# EAGLE design board (EAGLE 9.3.0)
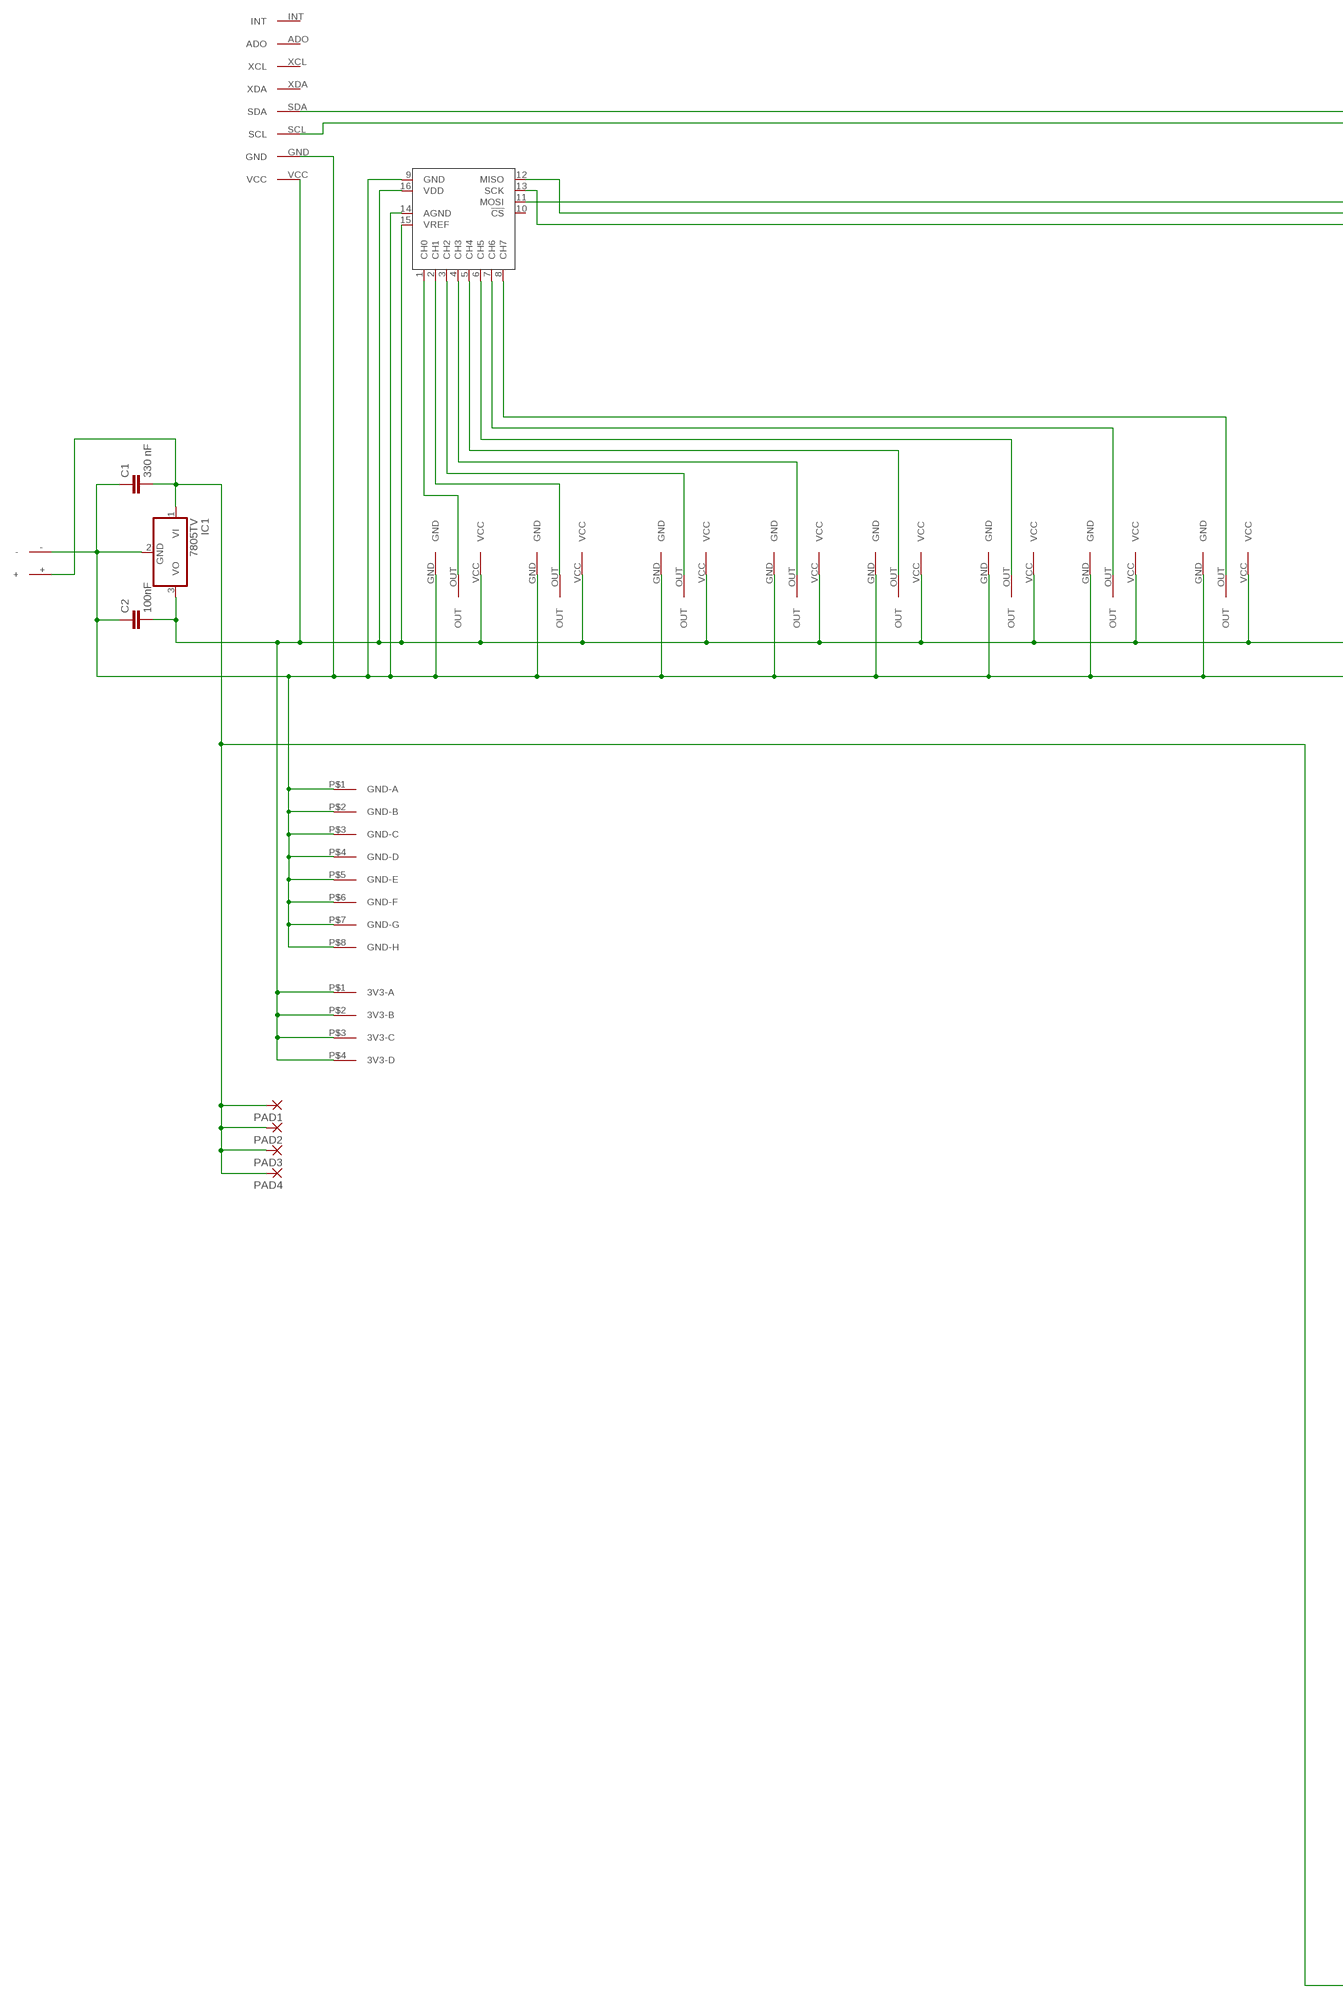
[diagram p0: schematic, sheet 1, part 1 of 2]
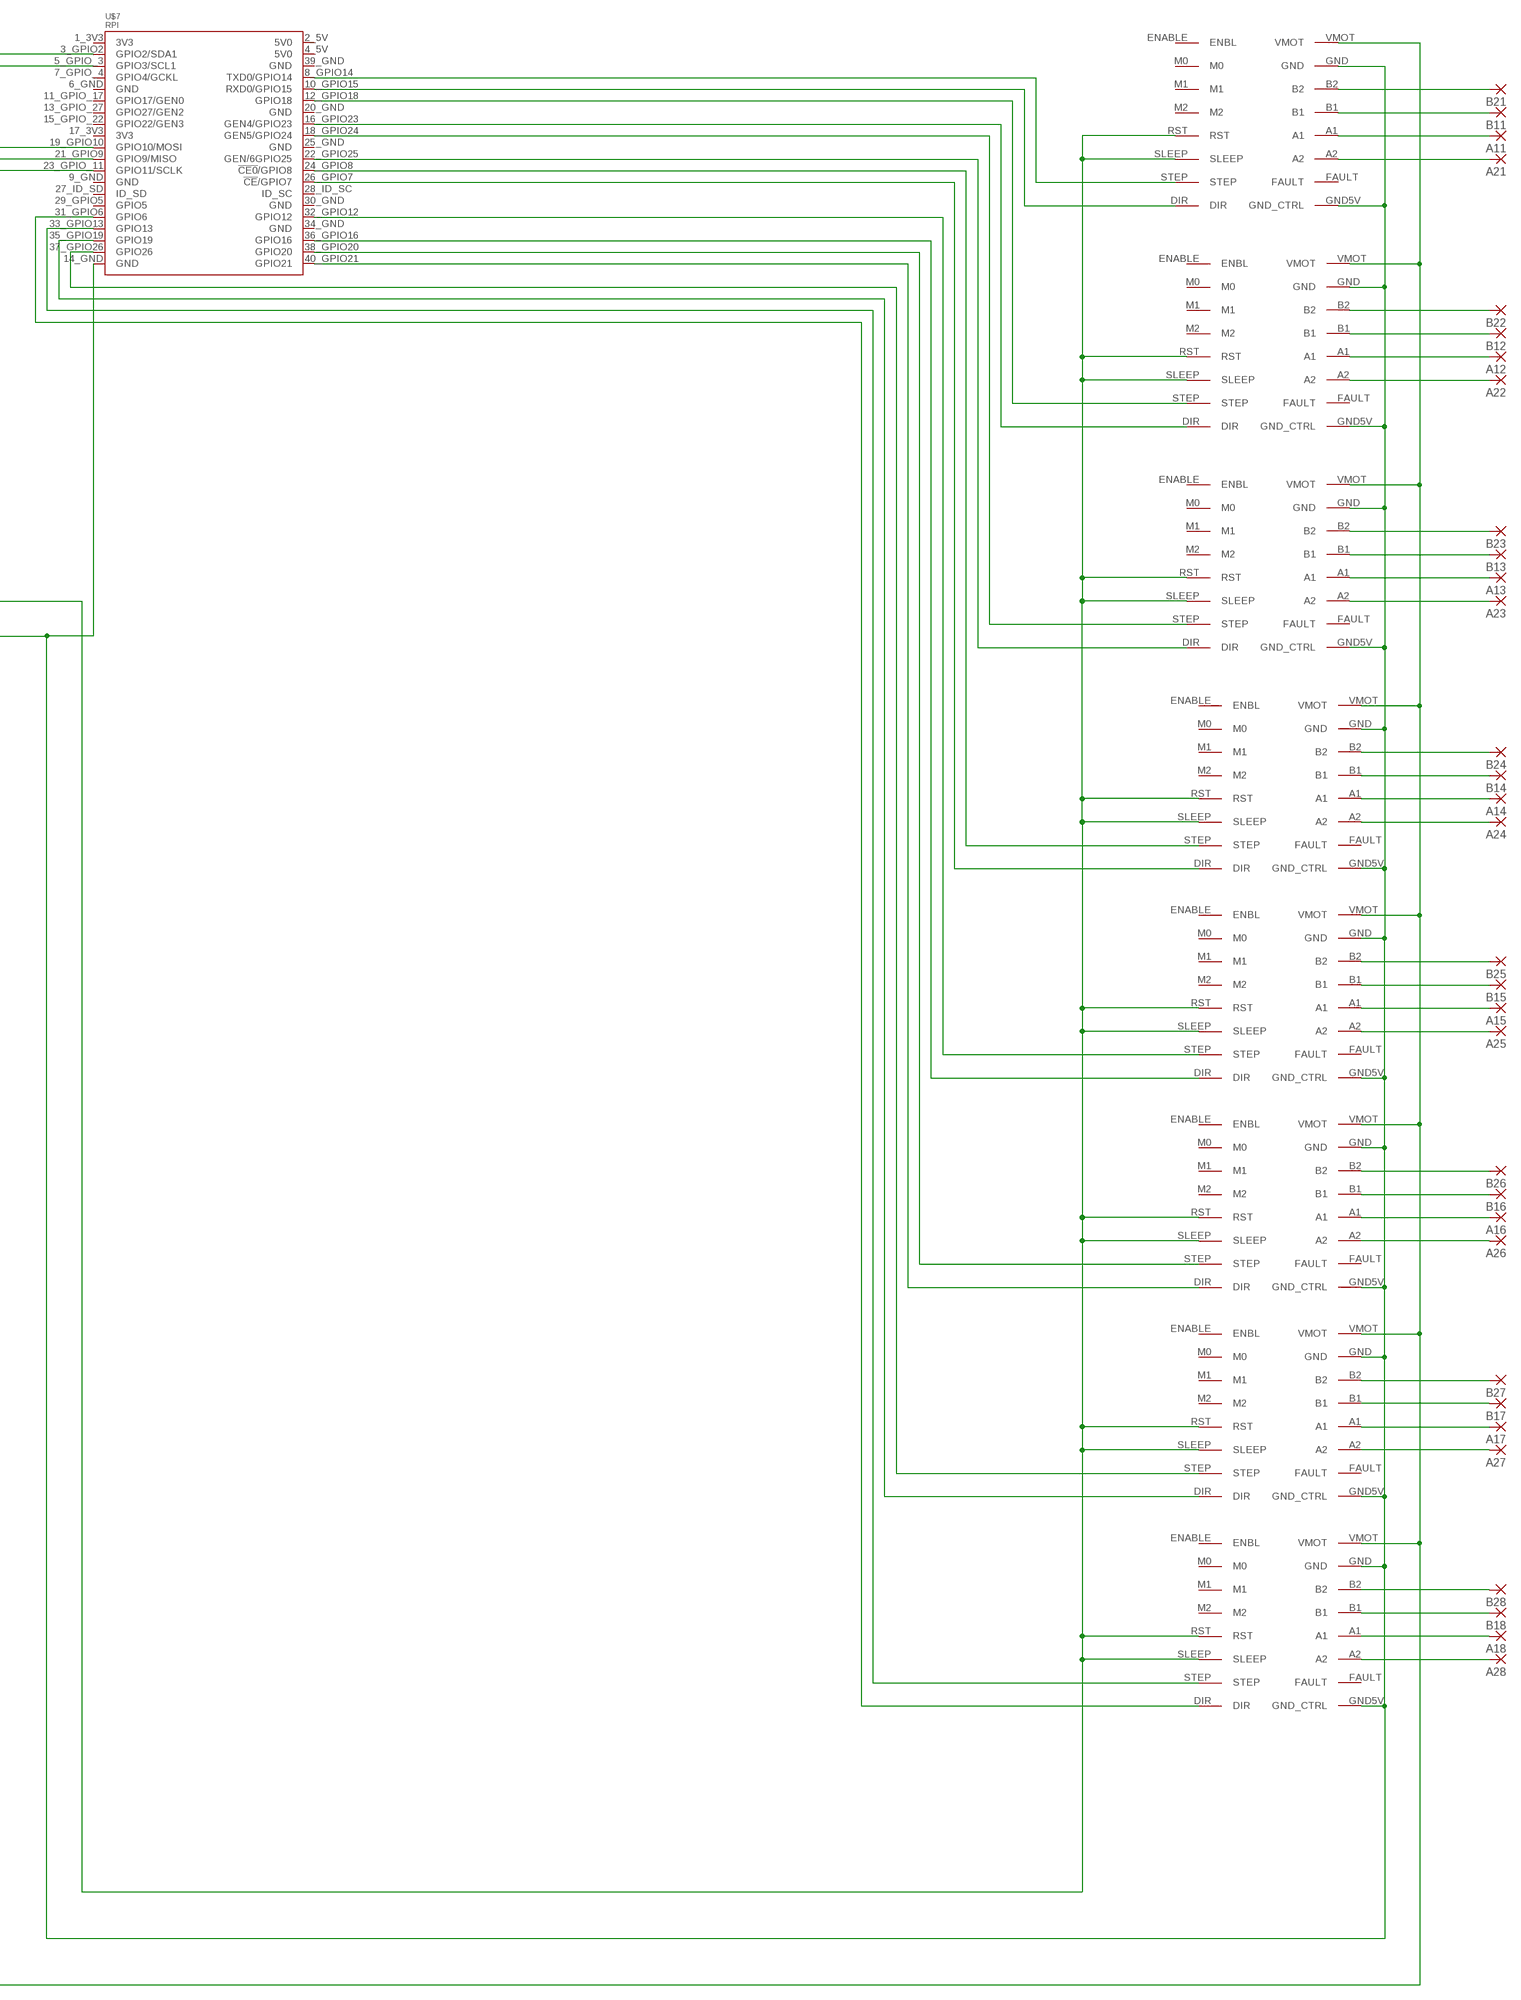
[diagram p1: schematic, sheet 1, part 2 of 2]

## Parts
A11  1,6/0,9  [1,6/0,9]
A12  1,6/0,9  [1,6/0,9]
A13  1,6/0,9  [1,6/0,9]
A14  1,6/0,9  [1,6/0,9]
A15  1,6/0,9  [1,6/0,9]
A16  1,6/0,9  [1,6/0,9]
A17  1,6/0,9  [1,6/0,9]
A18  1,6/0,9  [1,6/0,9]
A21  1,6/0,9  [1,6/0,9]
A22  1,6/0,9  [1,6/0,9]
A23  1,6/0,9  [1,6/0,9]
A24  1,6/0,9  [1,6/0,9]
A25  1,6/0,9  [1,6/0,9]
A26  1,6/0,9  [1,6/0,9]
A27  1,6/0,9  [1,6/0,9]
A28  1,6/0,9  [1,6/0,9]
B11  1,6/0,9  [1,6/0,9]
B12  1,6/0,9  [1,6/0,9]
B13  1,6/0,9  [1,6/0,9]
B14  1,6/0,9  [1,6/0,9]
B15  1,6/0,9  [1,6/0,9]
B16  1,6/0,9  [1,6/0,9]
B17  1,6/0,9  [1,6/0,9]
B18  1,6/0,9  [1,6/0,9]
B21  1,6/0,9  [1,6/0,9]
B22  1,6/0,9  [1,6/0,9]
B23  1,6/0,9  [1,6/0,9]
B24  1,6/0,9  [1,6/0,9]
B25  1,6/0,9  [1,6/0,9]
B26  1,6/0,9  [1,6/0,9]
B27  1,6/0,9  [1,6/0,9]
B28  1,6/0,9  [1,6/0,9]
C1  330 nF  C2.5/2  [C2.5-2]
C2  100nF  C2.5/2  [C2.5-2]
IC1  7805TV  [TO220V]
PAD1  1,6/0,9  [1,6/0,9]
PAD2  1,6/0,9  [1,6/0,9]
PAD3  1,6/0,9  [1,6/0,9]
PAD4  1,6/0,9  [1,6/0,9]
U$1  12V_SRC  [12V_SRC]
U$2  DISTANCE_SENSOR_ANALOG  [DISTANCE_SENSOR_ANALOG]
U$3  DISTANCE_SENSOR_ANALOG  [DISTANCE_SENSOR_ANALOG]
U$4  MCP3008P  [DIL16]
U$5  DISTANCE_SENSOR_ANALOG  [DISTANCE_SENSOR_ANALOG]
U$6  MPU6050  [MPU6050]
U$7  RPI  [RPI]
U$8  DISTANCE_SENSOR_ANALOG  [DISTANCE_SENSOR_ANALOG]
U$9  DISTANCE_SENSOR_ANALOG  [DISTANCE_SENSOR_ANALOG]
U$10  DISTANCE_SENSOR_ANALOG  [DISTANCE_SENSOR_ANALOG]
U$11  3V3-4  [3.3V-4]
U$12  GND-8  [GND-8]
U$13  DISTANCE_SENSOR_ANALOG  [DISTANCE_SENSOR_ANALOG]
U$14  DISTANCE_SENSOR_ANALOG  [DISTANCE_SENSOR_ANALOG]
U$15  DRV8825-SLOT  [DRV8825-SLOT]
U$16  DRV8825-SLOT  [DRV8825-SLOT]
U$17  DRV8825-SLOT  [DRV8825-SLOT]
U$18  DRV8825-SLOT  [DRV8825-SLOT]
U$19  DRV8825-SLOT  [DRV8825-SLOT]
U$20  DRV8825-SLOT  [DRV8825-SLOT]
U$21  DRV8825-SLOT  [DRV8825-SLOT]
U$22  DRV8825-SLOT  [DRV8825-SLOT]

## Nets
GND@3 [Power]: C1.1 C2.1 IC1.2(GND) U$1.- U$2.GND U$3.GND U$4.9(GND) U$4.14(AGND) U$5.GND U$6.GND U$7.14_GND(GND) U$8.GND U$9.GND U$10.GND U$12.P$1(GND-A) U$12.P$2(GND-B) U$12.P$3(GND-C) U$12.P$4(GND-D) U$12.P$5(GND-E) U$12.P$6(GND-F) U$12.P$7(GND-G) U$12.P$8(GND-H) U$13.GND U$14.GND U$15.GND U$15.GND5V(GND_CTRL) U$16.GND U$16.GND5V(GND_CTRL) U$17.GND U$17.GND5V(GND_CTRL) U$18.GND U$18.GND5V(GND_CTRL) U$19.GND U$19.GND5V(GND_CTRL) U$20.GND U$20.GND5V(GND_CTRL) U$21.GND U$21.GND5V(GND_CTRL) U$22.GND U$22.GND5V(GND_CTRL)
N$1: U$4.1(CH0) U$9.OUT
N$2: U$4.2(CH1) U$10.OUT
N$3: U$4.3(CH2) U$14.OUT
N$4: U$4.4(CH3) U$13.OUT
N$5: U$2.OUT U$4.5(CH4)
N$6: U$3.OUT U$4.6(CH5)
N$8: U$4.7(CH6) U$5.OUT
N$9: U$6.SDA U$7.3_GPIO2(GPIO2/SDA1)
N$10: U$4.8(CH7) U$8.OUT
N$11: U$6.SCL U$7.5_GPIO_3(GPIO3/SCL1)
N$12 [Power]: C2.2 IC1.3(VO) U$2.VCC U$3.VCC U$4.15(VREF) U$4.16(VDD) U$5.VCC U$6.VCC U$8.VCC U$9.VCC U$10.VCC U$11.P$1(3V3-A) U$11.P$2(3V3-B) U$11.P$3(3V3-C) U$11.P$4(3V3-D) U$13.VCC U$14.VCC U$15.RST U$15.SLEEP U$16.RST U$16.SLEEP U$17.RST U$17.SLEEP U$18.RST U$18.SLEEP U$19.RST U$19.SLEEP U$20.RST U$20.SLEEP U$21.RST U$21.SLEEP U$22.RST U$22.SLEEP
N$13 [Power]: C1.2 IC1.1(VI) PAD1.1(P) PAD2.1(P) PAD3.1(P) PAD4.1(P) U$1.+ U$15.VMOT U$16.VMOT U$17.VMOT U$18.VMOT U$19.VMOT U$20.VMOT U$21.VMOT U$22.VMOT
N$14: U$7.8_GPIO14(TXD0/GPIO14) U$15.STEP
N$15: U$4.11(MOSI) U$7.19_GPIO10(GPIO10/MOSI)
N$16: U$4.12(MISO) U$7.21_GPIO9(GPIO9/MISO)
N$17: U$4.13(SCK) U$7.23_GPIO_11(GPIO11/SCLK)
N$18: U$7.10_GPIO15(RXD0/GPIO15) U$15.DIR
N$19: U$7.12_GPIO18(GPIO18) U$16.STEP
N$20: U$7.16_GPIO23(GEN4/GPIO23) U$16.DIR
N$21: U$7.18_GPIO24(GEN5/GPIO24) U$17.STEP
N$22: U$7.22_GPIO25(GEN/6GPIO25) U$17.DIR
N$23: U$7.24_GPIO8(!CE0!/GPIO8) U$18.STEP
N$24: U$7.26_GPIO7(!CE!/GPIO7) U$18.DIR
N$25: B21.1(P) U$15.B2
N$26: B11.1(P) U$15.B1
N$27: A11.1(P) U$15.A1
N$28: A21.1(P) U$15.A2
N$29: B22.1(P) U$16.B2
N$30: B12.1(P) U$16.B1
N$31: B25.1(P) U$19.B2
N$32: A12.1(P) U$16.A1
N$33: A22.1(P) U$16.A2
N$34: B23.1(P) U$17.B2
N$35: B13.1(P) U$17.B1
N$36: A13.1(P) U$17.A1
N$37: A23.1(P) U$17.A2
N$38: B24.1(P) U$18.B2
N$39: B14.1(P) U$18.B1
N$40: A14.1(P) U$18.A1
N$41: A24.1(P) U$18.A2
N$43: B15.1(P) U$19.B1
N$47: A15.1(P) U$19.A1
N$48: A25.1(P) U$19.A2
N$49: B26.1(P) U$20.B2
N$50: B16.1(P) U$20.B1
N$51: A16.1(P) U$20.A1
N$52: A26.1(P) U$20.A2
N$53: B27.1(P) U$21.B2
N$54: B17.1(P) U$21.B1
N$55: A17.1(P) U$21.A1
N$56: A27.1(P) U$21.A2
N$57: B28.1(P) U$22.B2
N$58: B18.1(P) U$22.B1
N$59: A18.1(P) U$22.A1
N$60: A28.1(P) U$22.A2
N$61: U$7.32_GPIO12(GPIO12) U$19.STEP
N$62: U$7.36_GPIO16(GPIO16) U$19.DIR
N$63: U$7.38_GPIO20(GPIO20) U$20.STEP
N$64: U$7.40_GPIO21(GPIO21) U$20.DIR
N$65: U$7.37_GPIO26(GPIO26) U$21.STEP
N$66: U$7.35_GPIO19(GPIO19) U$21.DIR
N$67: U$7.33_GPIO13(GPIO13) U$22.STEP
N$68: U$7.31_GPIO6(GPIO6) U$22.DIR
Unconnected: U$4.10(!CS) U$6.ADO U$6.INT U$6.XCL U$6.XDA U$7.1_3V3(3V3) U$7.2_5V(5V0) U$7.4_5V(5V0) U$7.6_GND(GND) U$7.7_GPIO_4(GPIO4/GCKL) U$7.9_GND(GND) U$7.11_GPIO_17(GPIO17/GEN0) U$7.13_GPIO_27(GPIO27/GEN2) U$7.15_GPIO_22(GPIO22/GEN3) U$7.17_3V3(3V3) U$7.20_GND(GND) U$7.25_GND(GND) U$7.27_ID_SD(ID_SD) U$7.28_ID_SC(ID_SC) U$7.29_GPIO5(GPIO5) U$7.30_GND(GND) U$7.34_GND(GND) U$7.39_GND(GND) U$15.ENABLE(ENBL) U$15.FAULT U$15.M0 U$15.M1 U$15.M2 U$16.ENABLE(ENBL) U$16.FAULT U$16.M0 U$16.M1 U$16.M2 U$17.ENABLE(ENBL) U$17.FAULT U$17.M0 U$17.M1 U$17.M2 U$18.ENABLE(ENBL) U$18.FAULT U$18.M0 U$18.M1 U$18.M2 U$19.ENABLE(ENBL) U$19.FAULT U$19.M0 U$19.M1 U$19.M2 U$20.ENABLE(ENBL) U$20.FAULT U$20.M0 U$20.M1 U$20.M2 U$21.ENABLE(ENBL) U$21.FAULT U$21.M0 U$21.M1 U$21.M2 U$22.ENABLE(ENBL) U$22.FAULT U$22.M0 U$22.M1 U$22.M2

## Library data of the parts
A11-A18 A21-A28 B11-B18 B21-B28 PAD1-PAD4 = wirepad:1,6/0,9: THROUGH-HOLE PAD
C1 C2 = capacitor-wima:C: CAPACITOR naming: grid - package width
IC1 = linear:78*: Positive VOLTAGE REGULATOR Source: http://cache.national.com/ds/LM/LM78L05.pdf http://www.fairchildsemi.com/ds/LM/LM7805.pdf
U$1 = home-mind:12V_SRC
U$2 U$3 U$5 U$8-U$10 U$13 U$14 = home-mind:DISTANCE_SENSOR_ANALOG
U$4 = MCP3008:MCP3008
U$6 = home-mind:MPU6050
U$7 = home-mind:RPI
U$11 = home-mind:3V3-4
U$12 = home-mind:GND-8
U$15-U$22 = home-mind:DRV8825-SLOT

## Net classes
0 default: width 0.3 mm, drill 0.3 mm, clearance 0.3 mm
1 Power: width 1.2 mm, drill 0.5 mm, clearance 0.5 mm

## Board
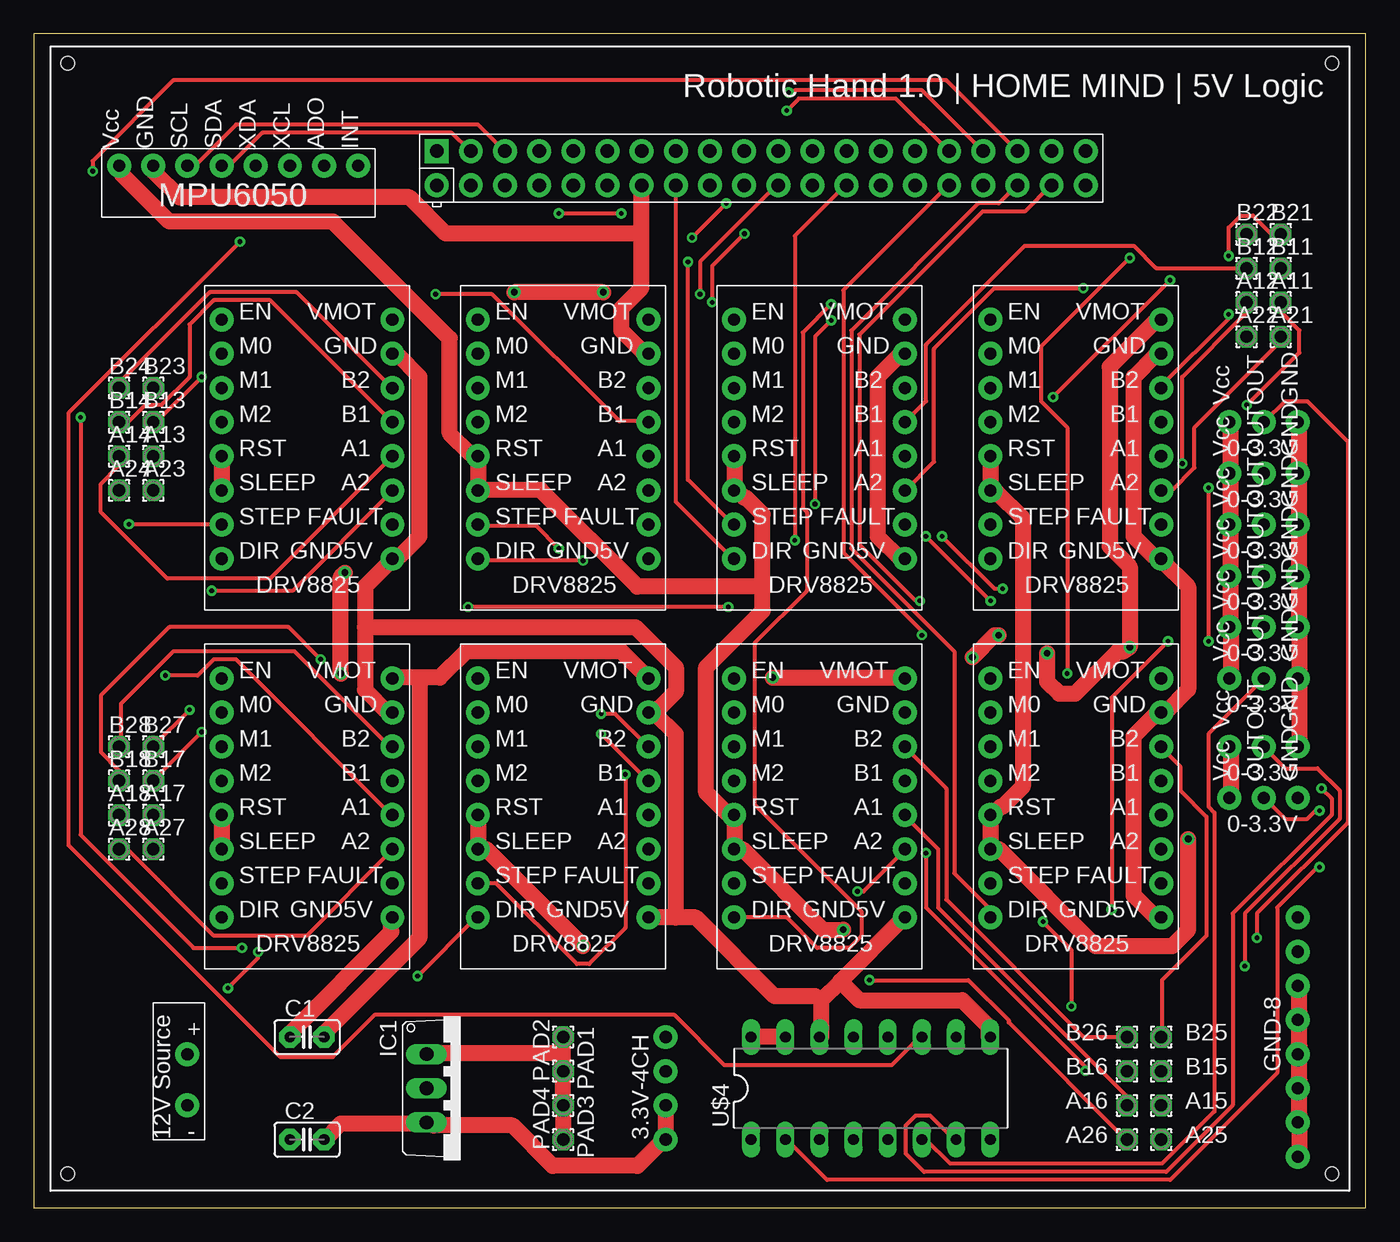
[diagram p2: board, top side]
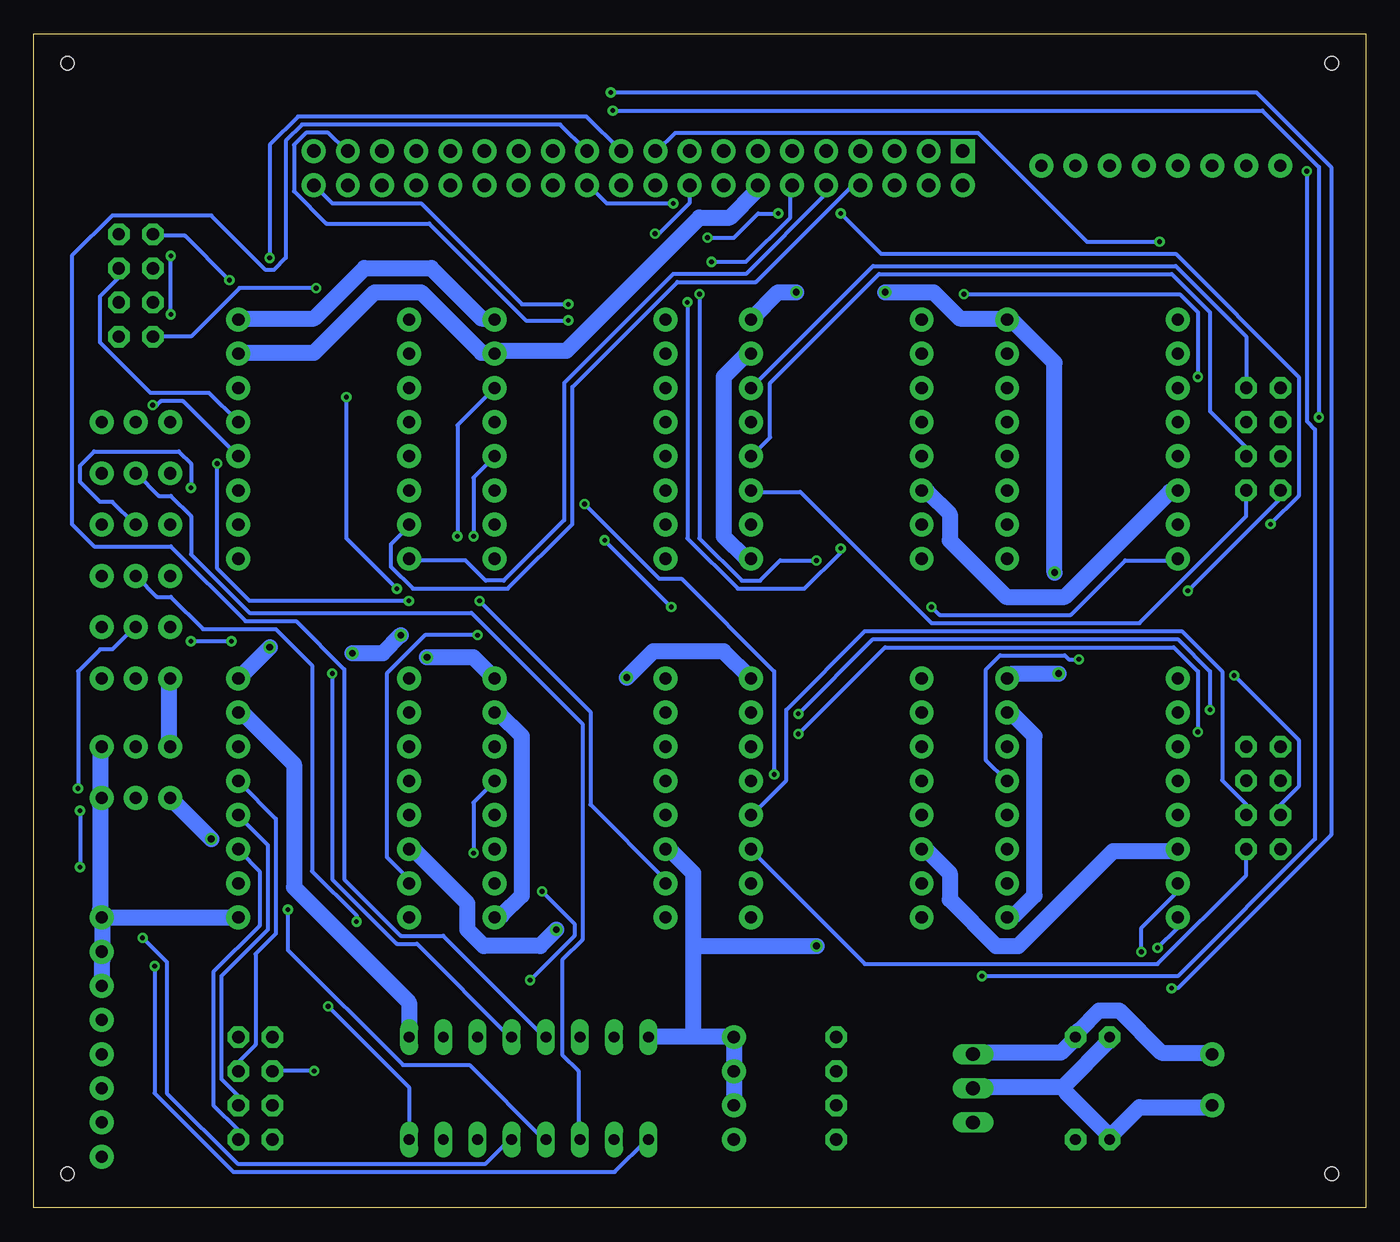
[diagram p3: board, bottom side, seen from below]

Size 99.04 x 87.3 mm. Coordinates in mm from the lower left corner, seen from the top.
Outline: 0,0 99.04,0 99.04,87.3 0,87.3 0,0
Copper layers (1*16): Top 0.035mm / dielectric 1.5mm / Bottom 0.035mm
Design rules "default": minimum track width 6mil, minimum drill 0.35mm, track to track 6mil, track to pad 6mil, pad to pad 6mil, via to via 6mil, smd to smd 6mil, copper to edge 40mil, drill to drill 6mil, minimum pad ring 10mil, minimum via ring 8mil, stop-mask expansion 4mil, vias tented up to drill 0mil, thermal gap 10mil
Holes 1 mm at 96.52,2.54 2.54,85.09 2.54,2.54 96.52,85.09

### Footprints (pad centres in the part's own frame; a part is rotated, then mirrored left to right if it is on the bottom)
1,6/0,9 = drill 0.914 pad 1.6 octagon: 1 0,0
C2.5-2 = drill 0.813 pad 1.6 octagon: 1 -1.27,0; 2 1.27,0
TO220V = drill 1.016 long: 1 -2.54,-2.54; 2 0,-2.54; 3 2.54,-2.54
12V_SRC = drill 0.9 pad 1.778: + 0,3.81; - 0,0
DISTANCE_SENSOR_ANALOG = drill 0.9 pad 1.778: GND 0,-2.54; OUT 0,0; VCC 0,2.54
DIL16 = drill 0.813 long: 1 -8.89,-3.81; 2 -6.35,-3.81; 3 -3.81,-3.81; 4 -1.27,-3.81; 5 1.27,-3.81; 6 3.81,-3.81; 7 6.35,-3.81; 8 8.89,-3.81; 9 8.89,3.81; 10 6.35,3.81; 11 3.81,3.81; 12 1.27,3.81; 13 -1.27,3.81; 14 -3.81,3.81; 15 -6.35,3.81; 16 -8.89,3.81
MPU6050 = drill 0.9 pad 1.778: ADO 0,-5.08; GND 0,7.62; INT 0,-7.62; SCL 0,5.08; SDA 0,2.54; VCC 0,10.16; XCL 0,-2.54; XDA 0,0
RPI = drill 1 pad 1.778 square: 1_3V3 -24.65,1.1 | drill 1 pad 1.778: 2_5V -24.65,-1.44; 3_GPIO2 -22.11,1.1; 4_5V -22.11,-1.44; 5_GPIO_3 -19.57,1.1; 6_GND -19.57,-1.44; 7_GPIO_4 -17.03,1.1; 8_GPIO14 -17.03,-1.44; 9_GND -14.49,1.1; 10_GPIO15 -14.49,-1.44; 11_GPIO_17 -11.95,1.1; 12_GPIO18 -11.95,-1.44; 13_GPIO_27 -9.41,1.1; 14_GND -9.41,-1.44; 15_GPIO_22 -6.87,1.1; 16_GPIO23 -6.87,-1.44; 17_3V3 -4.33,1.1; 18_GPIO24 -4.33,-1.44; 19_GPIO10 -1.79,1.1; 20_GND -1.79,-1.44; 21_GPIO9 0.75,1.1; 22_GPIO25 0.75,-1.44; 23_GPIO_11 3.29,1.1; 24_GPIO8 3.29,-1.44; 25_GND 5.83,1.1; 26_GPIO7 5.83,-1.44; 27_ID_SD 8.37,1.1; 28_ID_SC 8.37,-1.44; 29_GPIO5 10.91,1.1; 30_GND 10.91,-1.44; 31_GPIO6 13.45,1.1; 32_GPIO12 13.45,-1.44; 33_GPIO13 15.99,1.1; 34_GND 15.99,-1.44; 35_GPIO19 18.53,1.1; 36_GPIO16 18.53,-1.44; 37_GPIO26 21.07,1.1; 38_GPIO20 21.07,-1.44; 39_GND 23.61,1.1; 40_GPIO21 23.61,-1.44
3.3V-4 = drill 0.9 pad 1.778: P$1 0,0; P$2 2.54,0; P$3 5.08,0; P$4 7.62,0
GND-8 = drill 0.9 pad 1.778: P$1 0,0; P$2 2.54,0; P$3 5.08,0; P$4 7.62,0; P$5 10.16,0; P$6 12.7,0; P$7 15.24,0; P$8 17.78,0
DRV8825-SLOT = drill 0.9 pad 1.778: A1 6.35,-1.27; A2 6.35,-3.81; B1 6.35,1.27; B2 6.35,3.81; DIR -6.35,-8.89; ENABLE -6.35,8.89; FAULT 6.35,-6.35; GND 6.35,6.35; GND5V 6.35,-8.89; M0 -6.35,6.35; M1 -6.35,3.81; M2 -6.35,1.27; RST -6.35,-1.27; SLEEP -6.35,-3.81; STEP -6.35,-6.35; VMOT 6.35,8.89

### Placement (x,y rotation side)
A11  92.71,67.31 0 top
A12  90.17,67.31 0 top
A13  8.89,55.88 0 top
A14  6.35,55.88 0 top
A15  83.82,7.62 0 top
A16  81.28,7.62 0 top
A17  8.89,29.21 0 top
A18  6.35,29.21 0 top
A21  92.71,64.77 0 top
A22  90.17,64.77 0 top
A23  8.89,53.34 0 top
A24  6.35,53.34 0 top
A25  83.82,5.08 0 top
A26  81.28,5.08 0 top
A27  8.89,26.67 0 top
A28  6.35,26.67 0 top
B11  92.71,69.85 0 top
B12  90.17,69.85 0 top
B13  8.89,58.42 0 top
B14  6.35,58.42 0 top
B15  83.82,10.16 0 top
B16  81.28,10.16 0 top
B17  8.89,31.75 0 top
B18  6.35,31.75 0 top
B21  92.71,72.39 0 top
B22  90.17,72.39 0 top
B23  8.89,60.96 0 top
B24  6.35,60.96 0 top
B25  83.82,12.7 0 top
B26  81.28,12.7 0 top
B27  8.89,34.29 0 top
B28  6.35,34.29 0 top
C1  20.32,12.7 0 top
C2  20.32,5.08 0 top
IC1  31.75,8.89 270 top
PAD1  39.37,12.7 270 top
PAD2  39.37,10.16 90 top
PAD3  39.37,7.62 270 top
PAD4  39.37,5.08 90 top
U$1  11.43,7.62 0 top
U$2  91.44,58.42 90 top
U$3  91.44,39.37 90 top
U$4  62.23,8.89 0 top
U$5  91.44,43.18 90 top
U$6  16.51,77.47 90 top
U$7  54.61,77.47 0 top
U$8  91.44,46.99 90 top
U$9  91.44,34.29 90 top
U$10  91.44,30.48 90 top
U$11  46.99,5.08 90 top
U$12  93.98,3.81 90 top
U$13  91.44,50.8 90 top
U$14  91.44,54.61 90 top
U$15  77.47,57.15 0 top
U$16  58.42,57.15 0 top
U$17  39.37,57.15 0 top
U$18  20.32,57.15 0 top
U$19  77.47,30.48 0 top
U$20  58.42,30.48 0 top
U$21  39.37,30.48 0 top
U$22  20.32,30.48 0 top

### Tracks (layer width: path | path; a pad name or v marks a point on that pad's centre or on a via)
GND@3
  Top 1.2: 58.54,15.43 58.54,12.73 U$4.14 | 59.97,16.85 64.69,21.58 U$20.GND5V | 59.97,16.85 58.54,15.43 | 59.97,16.85 61.39,15.43 69.04,15.43 70.99,13.48 70.99,12.73 U$4.9 | 47.74,21.58 49.24,21.58 55.09,15.73 58.09,15.73 58.54,15.43 | 47.74,21.58 45.79,21.58 U$21.GND5V | 47.74,21.58 47.74,35.23 46.24,36.73 45.79,36.73 U$21.GND 46.54,37.18 47.74,38.38 47.74,40.18 44.74,43.18 24.64,43.18 | 24.64,43.18 24.64,46.18 26.59,48.13 U$18.GND5V 27.19,48.43 28.69,49.93 28.69,61.78 27.04,63.43 26.74,63.43 U$18.GND | 24.64,43.18 24.64,38.53 26.29,36.88 26.59,36.88 U$22.GND | U$22.GND5V 26.59,21.58 26.59,20.53 19.09,13.03 19.09,12.73 C1.1 | 45.19,72.43 45.19,68.38 43.69,66.88 43.69,65.23 45.34,63.58 45.64,63.58 U$17.GND | 45.19,72.43 U$7.14_GND | U$6.GND 8.89,77.08 10.84,75.13 27.94,75.13 30.64,72.43 45.19,72.43 | U$16.GND5V 64.69,48.28 64.39,48.28 62.74,49.93 62.74,61.78 64.39,63.43 64.69,63.43 U$16.GND | U$15.GND 83.74,63.43 83.44,63.43 81.79,61.78 81.79,49.93 83.29,48.43 U$15.GND5V 83.89,48.13 85.84,46.18 85.84,38.53 84.19,36.88 83.89,36.88 U$19.GND 83.29,36.58 81.79,35.08 81.79,23.23 83.29,21.73 83.74,21.73 U$19.GND5V | U$12.P$1 94.09,3.88 94.09,6.28 U$12.P$2 94.09,6.88 94.09,8.83 U$12.P$3 94.09,9.43 94.09,11.38 U$12.P$4 94.09,11.98 94.09,13.93 U$12.P$5 94.09,14.53 94.09,16.48 U$12.P$6 | U$2.GND 94.09,58.33 94.09,55.18 U$14.GND 94.09,54.58 94.09,51.28 U$13.GND 94.09,50.68 94.09,47.53 U$8.GND 94.09,46.93 94.09,43.63 U$5.GND 94.09,43.18 94.09,39.43 U$3.GND 94.09,38.83 94.09,34.33 U$9.GND
  Bottom 1.2: U$20.GND 64.69,36.73 64.39,36.73 62.74,35.08 62.74,23.23 64.24,21.73 64.69,21.73 U$20.GND5V | 22.54,8.98 29.14,8.98 IC1.2 | 22.54,8.98 18.94,12.58 C1.1 | 22.54,8.98 22.24,8.53 19.09,5.38 19.09,5.08 C2.1 18.64,5.68 16.84,7.48 11.44,7.48 U$1.- | U$22.GND 26.59,36.73 26.29,36.73 24.64,35.08 24.64,23.23 26.14,21.73 26.59,21.73 U$22.GND5V | U$17.GND5V 45.79,48.28 46.09,48.28 47.74,49.93 47.74,61.78 46.09,63.43 45.79,63.43 U$17.GND | U$15.GND 83.74,63.58 78.19,63.58 73.69,68.08 70.24,68.08 65.74,63.58 64.84,63.58 U$16.GND 64.24,63.73 59.44,63.73 49.54,73.63 47.29,73.63 45.34,75.58 45.34,76.03 U$7.14_GND | U$19.GND5V 83.89,21.58 93.94,21.58 U$12.P$8 | U$12.P$8 93.94,20.98 93.94,19.18 U$12.P$7 93.94,18.43 93.94,16.63 U$12.P$6 | U$9.GND 94.09,34.18 94.09,30.58 U$10.GND 94.09,29.98 94.09,22.18 U$12.P$8 | U$4.9 71.14,12.73 71.14,15.28 79.69,23.83 79.69,32.98 83.44,36.73 83.74,36.73 U$19.GND
N$1  (via drill 0.35)
  Top 0.3: v90.04,17.98 90.04,21.88 97.09,28.93 97.09,31.03 95.44,32.68 93.04,32.68 91.54,34.18 U$9.OUT
  Bottom 0.3: v90.04,17.98 90.04,8.53 84.19,2.68 55.84,2.68 53.44,5.08 U$4.1
N$2  (via drill 0.35)
  Top 0.3: v95.59,25.33 95.44,25.33 92.44,22.33 92.44,10.03 84.49,2.08 58.99,2.08 55.99,5.08 U$4.2 | v95.59,29.53 95.29,29.53 94.69,28.93 93.04,28.93 91.54,30.43 U$10.OUT
  Bottom 0.3: v95.59,29.53 v95.59,25.33
N$3
  Bottom 0.3: U$4.3 58.54,5.08 58.54,10.18 59.74,11.38 59.74,18.43 58.24,19.93 58.24,35.98 66.49,44.23 82.99,44.23 87.34,48.58 87.34,51.43 88.84,52.93 89.74,52.93 91.39,54.58 U$14.OUT
N$4  (via drill 0.35)
  Top 0.3: v80.14,22.18 80.14,37.93 v84.34,42.13 | v87.34,53.53 v87.34,42.13
  Bottom 0.3: v80.14,22.18 80.14,19.18 71.59,10.63 66.64,10.63 61.09,5.08 U$4.4 | v87.34,42.13 v84.34,42.13 | v87.34,53.53 87.34,55.33 88.24,56.23 94.54,56.23 95.59,55.18 95.59,53.98 94.09,52.48 93.19,52.48 91.54,50.83 U$13.OUT
N$5  (via drill 0.35)
  Top 0.3: v90.94,20.08 90.94,21.88 97.69,28.63 97.69,56.98 94.69,59.98 93.04,59.98 91.54,58.48 U$2.OUT
  Bottom 0.3: v90.94,20.08 89.14,18.28 89.14,8.53 83.89,3.28 65.44,3.28 63.64,5.08 U$4.5
N$6
  Top 0.3: U$4.6 66.34,5.08 68.14,3.28 83.89,3.28 87.79,7.18 87.79,29.38 87.34,29.83 87.34,35.23 91.39,39.28 U$3.OUT
N$8  (via drill 0.35)
  Top 0.3: v95.74,31.18 96.49,30.43 96.49,29.23 89.14,21.88 89.14,7.63 84.19,2.68 66.19,2.68 64.84,4.03 64.84,6.13 65.59,6.88 66.64,6.88 68.44,5.08 U$4.7
  Bottom 0.3: v95.74,31.18 95.74,39.88 94.09,41.53 93.19,41.53 91.54,43.18 U$5.OUT
N$9
  Top 0.3: U$6.SDA 13.99,77.53 14.59,77.53 16.99,79.93 31.09,79.93 32.44,78.58 U$7.3_GPIO2
N$10  (via drill 0.35)
  Top 0.3: v77.14,14.98 77.14,19.18 v75.04,21.28
  Bottom 0.3: v77.14,14.98 71.14,8.98 71.14,5.08 U$4.8 | v75.04,21.28 75.04,21.73 78.34,25.03 78.34,40.33 81.04,43.03 86.44,43.03 88.84,45.43 89.89,45.43 91.39,46.93 U$8.OUT
N$11
  Top 0.3: U$6.SCL 11.44,77.53 12.04,77.53 15.04,80.53 33.04,80.53 34.99,78.58 U$7.5_GPIO_3
N$12  (via drill 0.5)
  Top 1.2: U$18.SLEEP 13.99,53.38 13.99,55.78 U$18.RST | U$6.VCC 6.49,77.38 6.49,76.93 10.09,73.33 22.24,73.33 30.94,64.63 30.94,57.58 32.44,56.08 U$17.RST 33.04,55.78 33.04,53.38 U$17.SLEEP 33.64,53.38 37.69,53.38 44.89,46.18 54.19,46.18 | U$10.VCC 88.99,30.58 88.99,34.18 U$9.VCC | U$3.VCC 88.99,39.43 88.99,43.18 U$5.VCC 88.99,43.63 88.99,46.93 U$8.VCC 88.99,47.53 88.99,50.68 U$13.VCC 88.99,51.28 88.99,54.58 U$14.VCC 88.99,55.18 88.99,58.33 U$2.VCC | U$15.RST 71.14,55.78 71.14,53.38 U$15.SLEEP 71.59,53.23 73.54,51.28 73.54,31.33 72.04,29.83 71.89,29.83 71.59,29.53 U$19.RST 71.14,29.08 71.14,26.68 U$19.SLEEP 71.74,26.68 78.94,19.48 84.64,19.48 85.84,20.68 v85.84,27.43 | U$22.SLEEP 13.99,26.68 13.99,29.08 U$22.RST | U$21.RST 33.04,29.08 33.04,26.68 U$21.SLEEP 33.64,26.68 v40.84,19.48 | C2.2 21.64,5.08 22.84,6.28 29.14,6.28 IC1.3 29.74,6.13 35.59,6.13 38.59,3.13 44.89,3.13 46.54,4.78 U$11.P$1 U$11.P$2 | U$16.RST 52.09,55.78 52.09,53.38 U$16.SLEEP 52.54,53.08 52.84,52.78 52.99,52.78 54.19,51.58 54.19,46.18 | U$4.16 53.44,12.73 55.84,12.73 U$4.15 | 54.19,46.18 54.19,44.38 49.99,40.18 49.99,30.88 51.49,29.38 U$20.RST 52.09,29.08 52.09,26.68 U$20.SLEEP 52.69,26.68 58.69,20.68 v60.19,20.68
  Bottom 1.2: U$18.SLEEP 13.99,53.23 14.59,53.23 22.39,45.43 26.74,45.43 30.94,49.63 30.94,51.58 32.59,53.23 32.89,53.23 U$17.SLEEP | U$9.VCC 88.99,34.33 88.99,39.28 U$3.VCC | v85.84,27.43 88.84,30.43 U$10.VCC | U$22.SLEEP 13.99,26.53 18.79,26.53 25.84,19.48 27.49,19.48 30.94,22.93 30.94,24.88 32.59,26.53 32.89,26.53 U$21.SLEEP | 49.99,12.73 46.99,12.73 U$11.P$4 U$11.P$3 U$11.P$2 | 49.99,12.73 53.29,12.73 U$4.16 | 49.99,12.73 49.99,19.48 | 49.99,19.48 49.99,24.88 51.64,26.53 51.94,26.53 U$20.SLEEP | 49.99,19.48 v40.84,19.48 | v60.19,20.68 61.39,19.48 65.59,19.48 66.79,20.68 66.79,22.63 70.69,26.53 70.99,26.53 U$19.SLEEP
N$13  (via drill 0.5)
  Top 1.2: U$15.VMOT 83.74,65.98 83.44,65.98 79.99,62.53 79.99,49.18 81.49,47.68 v81.49,41.68 81.04,41.38 80.59,41.38 77.44,38.23 76.24,38.23 75.34,39.13 v75.34,41.23 | PAD4.1 39.34,5.08 39.34,7.48 PAD3.1 39.34,8.23 39.34,10.03 PAD2.1 39.34,10.78 39.34,11.53 | 39.34,11.53 39.34,12.58 PAD1.1 | 39.34,11.53 29.29,11.53 IC1.1 | v42.34,68.08 v35.74,68.08 | 28.69,39.43 30.19,39.43 32.14,41.38 43.69,41.38 45.64,39.43 U$21.VMOT | 28.69,39.43 26.74,39.43 U$22.VMOT | v54.94,39.43 64.69,39.43 U$20.VMOT | v23.14,47.23 22.84,46.93 v22.84,39.73 | 28.69,39.43 28.69,20.08 21.64,13.03 21.64,12.73 C1.2 | v71.74,42.58 71.44,42.58 v69.79,40.93
  Bottom 1.2: v81.49,41.68 83.74,39.43 U$19.VMOT | U$16.VMOT 64.84,66.13 65.74,66.13 69.49,69.88 74.44,69.88 78.19,66.13 83.74,66.13 U$15.VMOT | IC1.1 29.14,11.53 22.69,11.53 21.64,12.58 C1.2 21.34,13.18 19.84,14.68 18.34,14.68 15.19,11.53 11.44,11.53 U$1.+ | v35.74,68.08 32.14,68.08 30.19,66.13 26.74,66.13 U$18.VMOT 26.14,65.83 23.14,62.83 v23.14,47.23 | v42.34,68.08 43.69,68.08 45.64,66.13 U$17.VMOT | v54.94,39.43 52.99,41.38 47.74,41.38 45.79,39.43 U$21.VMOT | v22.84,39.73 26.29,39.73 26.59,39.43 U$22.VMOT | v75.34,41.23 73.09,41.23 v71.74,42.58 | v69.79,40.93 66.34,40.93 64.84,39.43 U$20.VMOT
N$14
  Bottom 0.3: U$7.8_GPIO14 38.14,76.03 45.34,68.83 51.19,68.83 58.99,61.03 58.99,50.83 63.79,46.03 70.84,46.03 72.49,47.68 72.49,49.33 71.14,50.68 U$15.STEP
N$15  (via drill 0.35)
  Top 0.3: v15.34,71.83 2.59,59.08 2.59,26.98 18.34,11.23 22.24,11.23 25.39,14.38 47.59,14.38 51.34,10.63 63.79,10.63 65.74,12.58 66.04,12.58 U$4.11
  Bottom 0.3: v15.34,71.83 20.74,71.83 28.84,79.93 51.34,79.93 52.69,78.58 U$7.19_GPIO10
N$16  (via drill 0.35)
  Top 0.3: v76.84,39.73 76.84,58.03 74.89,59.98 74.89,64.03 v81.49,70.63
  Bottom 0.3: v76.84,39.73 76.84,24.43 72.04,19.63 70.54,19.63 63.64,12.73 U$4.12 | v81.49,70.63 81.49,79.03 79.39,81.13 57.94,81.13 55.39,78.58 U$7.21_GPIO9
N$17
  Bottom 0.3: U$4.13 61.09,12.73 68.59,20.23 71.74,20.23 75.94,24.43 75.94,40.03 79.54,43.63 83.29,43.63 88.84,49.18 94.54,49.18 96.19,50.83 96.19,70.78 93.19,73.78 85.84,73.78 81.79,69.73 81.19,69.73 80.29,70.63 80.29,79.33 79.09,80.53 59.89,80.53 57.94,78.58 U$7.23_GPIO_11
N$18
  Bottom 0.3: U$15.DIR 70.99,48.13 66.94,48.13 65.44,46.63 64.09,46.63 59.59,51.13 59.59,61.33 51.49,69.43 46.09,69.43 40.24,75.28 40.24,76.03 U$7.10_GPIO15
N$19  (via drill 0.35)
  Top 0.3: v48.64,70.33 48.64,54.13 51.94,50.83 U$16.STEP
  Bottom 0.3: v48.64,70.33 46.09,70.33 42.79,73.63 42.79,76.03 U$7.12_GPIO18
N$20
  Top 0.3: U$7.16_GPIO23 47.74,52.48 51.94,48.28 U$16.DIR
N$21  (via drill 0.35)
  Top 0.3: v39.04,49.03 37.39,50.68 33.04,50.68 U$17.STEP | v50.44,67.33 50.44,70.03 v52.84,72.43
  Bottom 0.3: v39.04,49.03 39.04,48.73 41.74,46.03 46.69,46.03 50.44,49.78 v50.44,67.33 | v52.84,72.43 52.54,72.43 50.29,74.68 U$7.18_GPIO24
N$22  (via drill 0.35)
  Top 0.3: v40.84,48.13 33.04,48.13 U$17.DIR | v49.54,67.93 49.54,70.33 55.24,76.03 U$7.22_GPIO25
  Bottom 0.3: v40.84,48.13 43.54,48.13 45.04,46.63 46.39,46.63 49.54,49.78 v49.54,67.93
N$23  (via drill 0.35)
  Top 0.3: v7.09,50.83 13.84,50.83 U$18.STEP | v43.69,73.93 v39.04,73.93 | v51.49,74.68 v48.94,72.13
  Bottom 0.3: v7.09,50.83 4.99,52.93 4.99,61.78 14.14,70.93 36.04,70.93 v39.04,73.93 | v43.69,73.93 45.19,73.93 46.99,72.13 v48.94,72.13 | v51.49,74.68 56.44,74.68 57.79,76.03 U$7.24_GPIO8
N$24  (via drill 0.35)
  Top 0.3: v51.64,44.68 v32.29,44.68 | v56.59,49.63 56.59,72.28 60.34,76.03 U$7.26_GPIO7
  Bottom 0.3: v32.29,44.68 31.69,44.08 21.94,44.08 17.89,48.13 13.99,48.13 U$18.DIR | v56.59,49.63 v51.64,44.68
N$25  (via drill 0.35)
  Top 0.3: v88.84,70.78 88.84,72.88 89.74,73.78 90.64,73.78 91.99,72.43 92.59,72.43 B21.1 | v88.84,66.43 88.84,66.13 83.74,61.03 U$15.B2
  Bottom 0.3: v88.84,66.43 v88.84,70.78
N$26
  Bottom 0.3: B11.1 92.74,69.73 92.74,69.13 94.09,67.78 94.09,64.33 90.34,60.58 85.99,60.58 83.89,58.48 U$15.B1
N$27  (via drill 0.35)
  Top 0.3: v90.19,59.68 94.09,63.58 94.09,65.23 92.74,66.58 92.74,67.18 A11.1
  Bottom 0.3: v90.19,59.68 89.89,59.68 89.59,59.98 87.94,59.98 83.89,55.93 U$15.A1
N$28
  Top 0.3: A21.1 92.59,64.63 92.59,64.33 86.29,58.03 86.29,55.03 84.64,53.38 83.89,53.38 U$15.A2
N$29  (via drill 0.35)
  Top 0.3: v75.79,60.28 v84.49,68.98 | v72.04,46.03 71.44,46.03 v67.54,49.93
  Bottom 0.3: v84.49,68.98 87.79,72.28 90.04,72.28 B22.1 | v75.79,60.28 75.79,49.78 v72.04,46.03 | v67.54,49.93 67.54,58.18 64.84,60.88 U$16.B2
N$30
  Top 0.3: B12.1 90.04,69.88 83.44,69.88 81.79,71.53 73.69,71.53 66.34,64.18 66.34,59.98 64.84,58.48 U$16.B1
N$31
  Top 0.3: B25.1 83.89,12.73 83.89,16.93 87.19,20.23 87.19,29.08 85.24,31.03 85.24,32.83 83.89,34.18 U$19.B2
N$32  (via drill 0.35)
  Top 0.3: v85.39,55.33 85.39,61.78 90.04,66.43 90.04,67.18 A12.1 | v66.34,49.93 v71.14,45.13
  Bottom 0.3: v85.39,55.33 85.39,47.53 82.99,45.13 v71.14,45.13 | v66.34,49.93 66.34,54.28 64.84,55.78 U$16.A1
N$33  (via drill 0.35)
  Top 0.3: v78.04,68.38 71.44,68.38 66.94,63.88 66.94,55.48 64.84,53.38 U$16.A2
  Bottom 0.3: v78.04,68.38 83.74,68.38 87.34,64.78 90.04,64.78 A22.1
N$34
  Bottom 0.3: B23.1 8.89,64.78 14.14,70.03 36.64,70.03 45.64,61.03 U$17.B2
N$35  (via drill 0.35)
  Top 0.3: v12.49,61.78 9.19,58.48 8.89,58.48 B13.1 | v29.89,67.93 34.09,67.93 43.54,58.48 45.64,58.48 U$17.B1
  Bottom 0.3: v12.49,61.78 12.49,66.58 13.84,67.93 v29.89,67.93
N$36
  Bottom 0.3: A13.1 8.89,56.53 11.59,59.23 11.59,66.58 14.44,69.43 36.19,69.43 44.29,61.33 44.29,57.28 45.64,55.93 U$17.A1
N$37
  Bottom 0.3: A23.1 8.89,51.43 16.84,43.48 32.29,43.48 42.04,53.23 45.64,53.23 U$17.A2
N$38
  Top 0.3: B24.1 6.49,61.03 6.49,61.48 13.09,68.08 19.54,68.08 26.59,61.03 U$18.B2
N$39
  Top 0.3: B14.1 6.49,58.48 7.09,58.48 8.29,59.68 9.49,59.68 11.59,61.78 11.59,65.68 13.39,67.48 17.59,67.48 26.59,58.48 U$18.B1
N$40
  Top 0.3: A14.1 6.34,55.78 6.34,55.18 4.99,53.83 4.99,51.73 9.94,46.78 17.59,46.78 26.59,55.78 U$18.A1
N$41  (via drill 0.35)
  Top 0.3: v13.24,45.88 19.24,45.88 26.59,53.23 U$18.A2
  Bottom 0.3: v13.24,45.88 6.49,52.63 6.49,53.23 A24.1
N$43
  Bottom 0.3: B15.1 83.74,10.18 83.74,10.93 82.54,12.13 82.54,18.88 81.04,20.38 81.04,28.93 83.74,31.63 U$19.B1
N$47
  Bottom 0.3: A15.1 83.89,7.63 83.89,8.38 85.09,9.58 85.09,17.23 81.64,20.68 81.64,26.98 83.74,29.08 U$19.A1
N$48
  Bottom 0.3: A25.1 83.89,5.08 83.89,5.83 85.69,7.63 85.69,17.53 82.24,20.98 82.24,25.03 83.74,26.53 U$19.A2
N$49
  Top 0.3: B26.1 81.19,12.73 78.04,12.73 67.84,22.93 67.84,31.18 64.84,34.18 U$20.B2
N$50  (via drill 0.35)
  Top 0.3: v78.19,10.18 78.19,10.48 66.34,22.33 v66.34,26.38
  Bottom 0.3: v78.19,10.18 81.19,10.18 B16.1 | v66.34,26.38 66.34,30.13 64.84,31.63 U$20.B1
N$51
  Top 0.3: A16.1 81.19,7.63 81.19,8.38 67.24,22.33 67.24,26.68 64.84,29.08 U$20.A1
N$52  (via drill 0.35)
  Top 0.3: v62.14,16.93 69.49,16.93 72.49,13.93 72.49,13.78 81.19,5.08 A26.1 | v61.24,23.53 61.69,23.53 64.69,26.53 U$20.A2
  Bottom 0.3: v62.14,16.93 58.84,20.23 58.84,21.13 v61.24,23.53
N$53  (via drill 0.35)
  Top 0.3: v11.59,37.03 8.89,34.33 B27.1 | v42.19,36.73 43.24,36.73 45.64,34.33 U$21.B2
  Bottom 0.3: v11.59,37.03 11.59,39.88 13.99,42.28 36.64,42.28 v42.19,36.73
N$54  (via drill 0.35)
  Top 0.3: v12.49,35.38 8.89,31.78 B17.1 | v42.19,35.23 45.64,31.78 U$21.B1
  Bottom 0.3: v12.49,35.38 12.49,39.88 14.29,41.68 35.74,41.68 v42.19,35.23
N$55
  Bottom 0.3: A17.1 8.89,29.98 10.69,31.78 10.69,39.88 13.69,42.88 37.24,42.88 43.09,37.03 43.09,31.78 45.64,29.23 U$21.A1
N$56
  Bottom 0.3: A27.1 8.89,24.73 15.49,18.13 37.24,18.13 45.64,26.53 U$21.A2
N$57
  Top 0.3: B28.1 6.49,34.33 6.49,37.48 10.39,41.38 19.39,41.38 26.59,34.18 U$22.B2
N$58  (via drill 0.35)
  Top 0.3: v21.34,40.78 18.94,43.18 10.09,43.18 4.99,38.08 4.99,33.88 6.34,32.53 6.34,31.78 B18.1
  Bottom 0.3: v21.34,40.78 22.09,40.78 22.39,41.08 27.19,41.08 28.24,40.03 28.24,33.28 26.74,31.78 U$22.B1
N$59  (via drill 0.35)
  Top 0.3: v9.79,39.58 12.19,39.58 13.39,40.78 15.04,40.78 26.59,29.23 U$22.A1
  Bottom 0.3: v9.79,39.58 4.99,34.78 4.99,31.33 6.34,29.98 6.34,29.23 A18.1
N$60
  Top 0.3: A28.1 6.49,26.53 7.09,26.53 13.39,20.23 20.29,20.23 26.59,26.53 U$22.A2
N$61  (via drill 0.35)
  Top 0.3: v66.04,42.58 66.04,42.88 60.19,48.73 60.19,68.23 67.99,76.03 U$7.32_GPIO12
  Bottom 0.3: v66.04,42.58 69.94,42.58 72.79,39.73 72.79,26.08 71.14,24.43 71.14,24.13 U$19.STEP
N$62
  Top 0.3: U$19.DIR 70.99,21.73 70.99,22.33 68.44,24.88 68.44,41.38 60.79,49.03 60.79,65.23 70.24,74.68 71.74,74.68 73.09,76.03 U$7.36_GPIO16
N$63  (via drill 0.35)
  Top 0.3: v65.89,45.13 65.59,45.13 61.39,49.33 61.39,64.93 70.54,74.08 73.69,74.08 75.64,76.03 U$7.38_GPIO20
  Bottom 0.3: v65.89,45.13 57.64,36.88 57.64,29.98 52.09,24.43 52.09,24.13 U$20.STEP
N$64  (via drill 0.35)
  Top 0.3: v59.29,67.18 57.19,65.08 57.19,52.03 57.49,51.73 57.49,45.88 53.59,41.98 53.59,29.98 61.54,22.03 61.54,20.23 60.64,19.33 58.24,19.33 55.99,21.58 52.09,21.58 U$20.DIR
  Bottom 0.3: v59.29,67.18 62.74,67.18 70.24,74.68 76.84,74.68 78.19,76.03 U$7.40_GPIO21
N$65  (via drill 0.35)
  Top 0.3: U$21.STEP 34.39,24.13 40.39,18.13 41.29,18.13 43.99,20.83 v43.99,32.23 | v58.09,52.33 58.09,64.78 v59.29,65.98
  Bottom 0.3: v43.99,32.23 43.99,39.88 50.89,46.78 52.54,46.78 v58.09,52.33 | v59.29,65.98 62.44,65.98 69.64,73.18 77.29,73.18 79.69,75.58 79.69,79.03 78.79,79.93 77.14,79.93 75.79,78.58 U$7.37_GPIO26
N$66  (via drill 0.35)
  Top 0.3: v28.54,17.23 32.89,21.58 U$21.DIR | v4.39,77.08 4.39,77.83 10.39,83.83 67.84,83.83 73.09,78.58 U$7.35_GPIO19
  Bottom 0.3: v28.54,17.23 13.99,17.23 3.79,27.43 3.79,57.88 4.39,58.48 v4.39,77.08
N$67  (via drill 0.35)
  Top 0.3: v16.69,19.03 16.69,18.58 v14.44,16.33 | v56.14,82.93 56.44,82.93 56.59,83.08 66.04,83.08 70.54,78.58 U$7.33_GPIO13
  Bottom 0.3: v16.69,19.03 16.69,20.83 13.99,23.53 13.99,24.13 U$22.STEP | v14.44,16.33 13.99,16.33 2.59,27.73 2.59,77.38 8.14,82.93 v56.14,82.93
N$68  (via drill 0.35)
  Top 0.3: v15.49,19.33 11.89,19.33 3.49,27.73 v3.49,58.78 | v55.99,81.58 56.89,82.48 64.09,82.48 67.99,78.58 U$7.31_GPIO6
  Bottom 0.3: v15.49,19.33 13.99,20.83 13.99,21.58 U$22.DIR | v3.49,58.78 3.49,77.38 7.69,81.58 v55.99,81.58

### Text on the board
tNames: Robotic Hand 1.0 | HOME MIND | 5V Logic